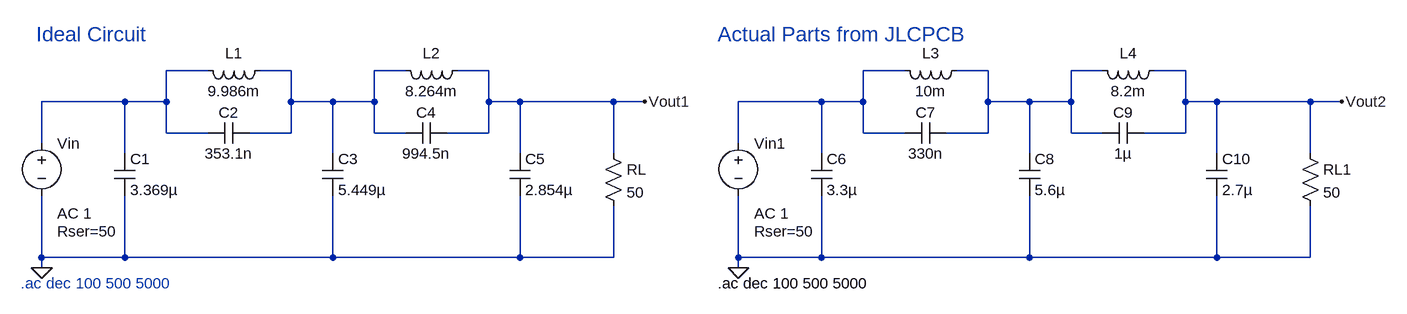
[diagram p0: schematic LPFilter_1kHz_Elliptical.asc]
LPFilter_1kHz_Elliptical.asc, the LTspice schematic file:
Version 4.1
SHEET 1 1236 728
WIRE -736 -96 -800 -96
WIRE -608 -96 -656 -96
WIRE -432 -96 -480 -96
WIRE -304 -96 -352 -96
WIRE 336 -96 272 -96
WIRE 464 -96 416 -96
WIRE 640 -96 592 -96
WIRE 768 -96 720 -96
WIRE -864 -48 -992 -48
WIRE -800 -48 -800 -96
WIRE -800 -48 -864 -48
WIRE -608 -48 -608 -96
WIRE -544 -48 -608 -48
WIRE -480 -48 -480 -96
WIRE -480 -48 -544 -48
WIRE -304 -48 -304 -96
WIRE -256 -48 -304 -48
WIRE -112 -48 -256 -48
WIRE -64 -48 -112 -48
WIRE 208 -48 80 -48
WIRE 272 -48 272 -96
WIRE 272 -48 208 -48
WIRE 464 -48 464 -96
WIRE 528 -48 464 -48
WIRE 592 -48 592 -96
WIRE 592 -48 528 -48
WIRE 768 -48 768 -96
WIRE 816 -48 768 -48
WIRE 960 -48 816 -48
WIRE 1008 -48 960 -48
WIRE -800 0 -800 -48
WIRE -736 0 -800 0
WIRE -608 0 -608 -48
WIRE -608 0 -672 0
WIRE -480 0 -480 -48
WIRE -432 0 -480 0
WIRE -304 0 -304 -48
WIRE -304 0 -368 0
WIRE 272 0 272 -48
WIRE 336 0 272 0
WIRE 464 0 464 -48
WIRE 464 0 400 0
WIRE 592 0 592 -48
WIRE 640 0 592 0
WIRE 768 0 768 -48
WIRE 768 0 704 0
WIRE -992 16 -992 -48
WIRE 80 16 80 -48
WIRE -864 32 -864 -48
WIRE -544 32 -544 -48
WIRE -256 32 -256 -48
WIRE -112 32 -112 -48
WIRE 208 32 208 -48
WIRE 528 32 528 -48
WIRE 816 32 816 -48
WIRE 960 32 960 -48
WIRE -992 192 -992 96
WIRE -864 192 -864 96
WIRE -864 192 -992 192
WIRE -544 192 -544 96
WIRE -544 192 -864 192
WIRE -256 192 -256 96
WIRE -256 192 -544 192
WIRE -112 192 -112 112
WIRE -112 192 -256 192
WIRE 80 192 80 96
WIRE 208 192 208 96
WIRE 208 192 80 192
WIRE 528 192 528 96
WIRE 528 192 208 192
WIRE 816 192 816 96
WIRE 816 192 528 192
WIRE 960 192 960 112
WIRE 960 192 816 192
WIRE -992 208 -992 192
WIRE 80 208 80 192
FLAG -992 208 0
FLAG 80 208 0
FLAG -64 -48 Vout1
FLAG 1008 -48 Vout2
SYMBOL voltage -992 0 R0
WINDOW 123 24 124 Left 2
WINDOW 39 24 152 Left 2
SYMATTR Value2 AC 1
SYMATTR SpiceLine Rser=50
SYMATTR InstName Vin
SYMATTR Value ""
SYMBOL cap -880 32 R0
SYMATTR InstName C1
SYMATTR Value 3.369µ
SYMBOL cap -672 -16 R90
WINDOW 0 0 32 VBottom 2
WINDOW 3 32 32 VTop 2
SYMATTR InstName C2
SYMATTR Value 353.1n
SYMBOL ind -640 -112 R90
WINDOW 0 5 56 VBottom 2
WINDOW 3 32 56 VTop 2
SYMATTR InstName L1
SYMATTR Value 9.986m
SYMBOL cap -560 32 R0
SYMATTR InstName C3
SYMATTR Value 5.449µ
SYMBOL cap -368 -16 R90
WINDOW 0 0 32 VBottom 2
WINDOW 3 32 32 VTop 2
SYMATTR InstName C4
SYMATTR Value 994.5n
SYMBOL ind -336 -112 R90
WINDOW 0 5 56 VBottom 2
WINDOW 3 32 56 VTop 2
SYMATTR InstName L2
SYMATTR Value 8.264m
SYMBOL cap -272 32 R0
SYMATTR InstName C5
SYMATTR Value 2.854µ
SYMBOL res -128 16 R0
SYMATTR InstName RL
SYMATTR Value 50
SYMBOL voltage 80 0 R0
WINDOW 123 24 124 Left 2
WINDOW 39 24 152 Left 2
SYMATTR Value2 AC 1
SYMATTR SpiceLine Rser=50
SYMATTR InstName Vin1
SYMATTR Value ""
SYMBOL cap 192 32 R0
SYMATTR InstName C6
SYMATTR Value 3.3µ
SYMBOL cap 400 -16 R90
WINDOW 0 0 32 VBottom 2
WINDOW 3 32 32 VTop 2
SYMATTR InstName C7
SYMATTR Value 330n
SYMBOL ind 432 -112 R90
WINDOW 0 5 56 VBottom 2
WINDOW 3 32 56 VTop 2
SYMATTR InstName L3
SYMATTR Value 10m
SYMATTR SpiceLine Rser=14.2
SYMBOL cap 512 32 R0
SYMATTR InstName C8
SYMATTR Value 5.6µ
SYMBOL cap 704 -16 R90
WINDOW 0 0 32 VBottom 2
WINDOW 3 32 32 VTop 2
SYMATTR InstName C9
SYMATTR Value 1µ
SYMBOL ind 736 -112 R90
WINDOW 0 5 56 VBottom 2
WINDOW 3 32 56 VTop 2
SYMATTR InstName L4
SYMATTR Value 8.2m
SYMATTR SpiceLine Rser=10
SYMBOL cap 800 32 R0
SYMATTR InstName C10
SYMATTR Value 2.7µ
SYMBOL res 944 16 R0
SYMATTR InstName RL1
SYMATTR Value 50
TEXT -1024 232 Left 2 ;.ac dec 100 500 5000
TEXT 48 232 Left 2 !.ac dec 100 500 5000
TEXT -1000 -152 Left 3 ;Ideal Circuit
TEXT 48 -152 Left 3 ;Actual Parts from JLCPCB

The netlist it stands for:
* LPFilter_1kHz_Elliptical.asc
Vin N001 0 AC 1 Rser=50
C1 N001 0 3.369µ
C2 N002 N001 353.1n
L1 N002 N001 9.986m
C3 N002 0 5.449µ
C4 Vout1 N002 994.5n
L2 Vout1 N002 8.264m
C5 Vout1 0 2.854µ
RL Vout1 0 50
Vin1 N003 0 AC 1 Rser=50
C6 N003 0 3.3µ
C7 N004 N003 330n
L3 N004 N003 10m Rser=14.2
C8 N004 0 5.6µ
C9 Vout2 N004 1µ
L4 Vout2 N004 8.2m Rser=10
C10 Vout2 0 2.7µ
RL1 Vout2 0 50
* .ac dec 100 500 5000
.ac dec 100 500 5000
* Ideal Circuit
* Actual Parts from JLCPCB
.backanno
.end

* Results of the author's LTspice run, read from the files saved beside the schematic
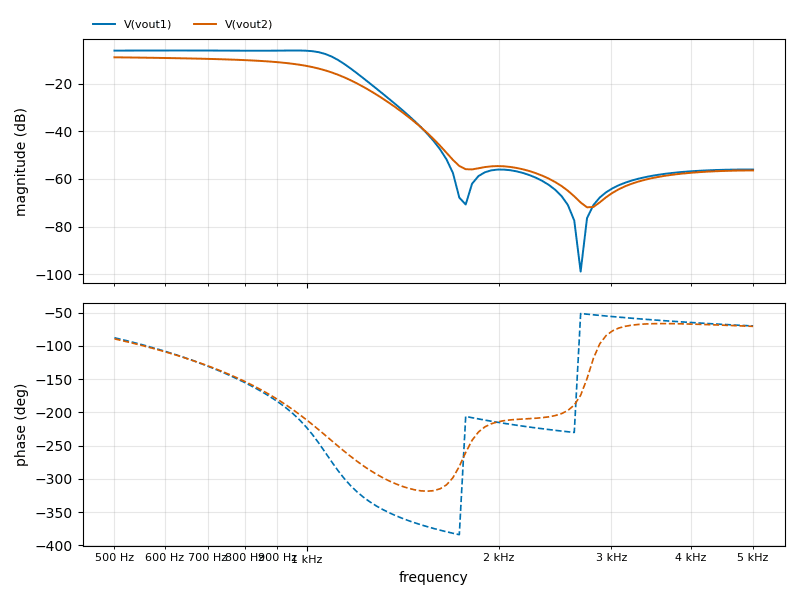
[diagram p1: AC Analysis of LPFilter_1kHz_Elliptical.asc, plotted from the saved traces]
* AC Analysis, 1 run:
*   V(vout1): -6.07 dB at 500 Hz, -56.02 dB at 5 kHz, peak -6.02 dB at 629.5 Hz, 3 dB below the peak at 1.102 kHz
*   V(vout2): -8.88 dB at 500 Hz, -56.41 dB at 5 kHz, peak -8.88 dB at 500 Hz, 3 dB below the peak at 967.7 Hz